# Altium schematic sheet Sheet_2.SchDoc: R2C2 - RepRapCncController
size A3; DrawnBy: FMendes75@gmail.com; Revision: V1.2P; SheetNumber: 2; SheetTotal: 3; =Revision: V1.1; license: Creative Commons BY-NC-SA; site: www.3dprinting-r2c2.com
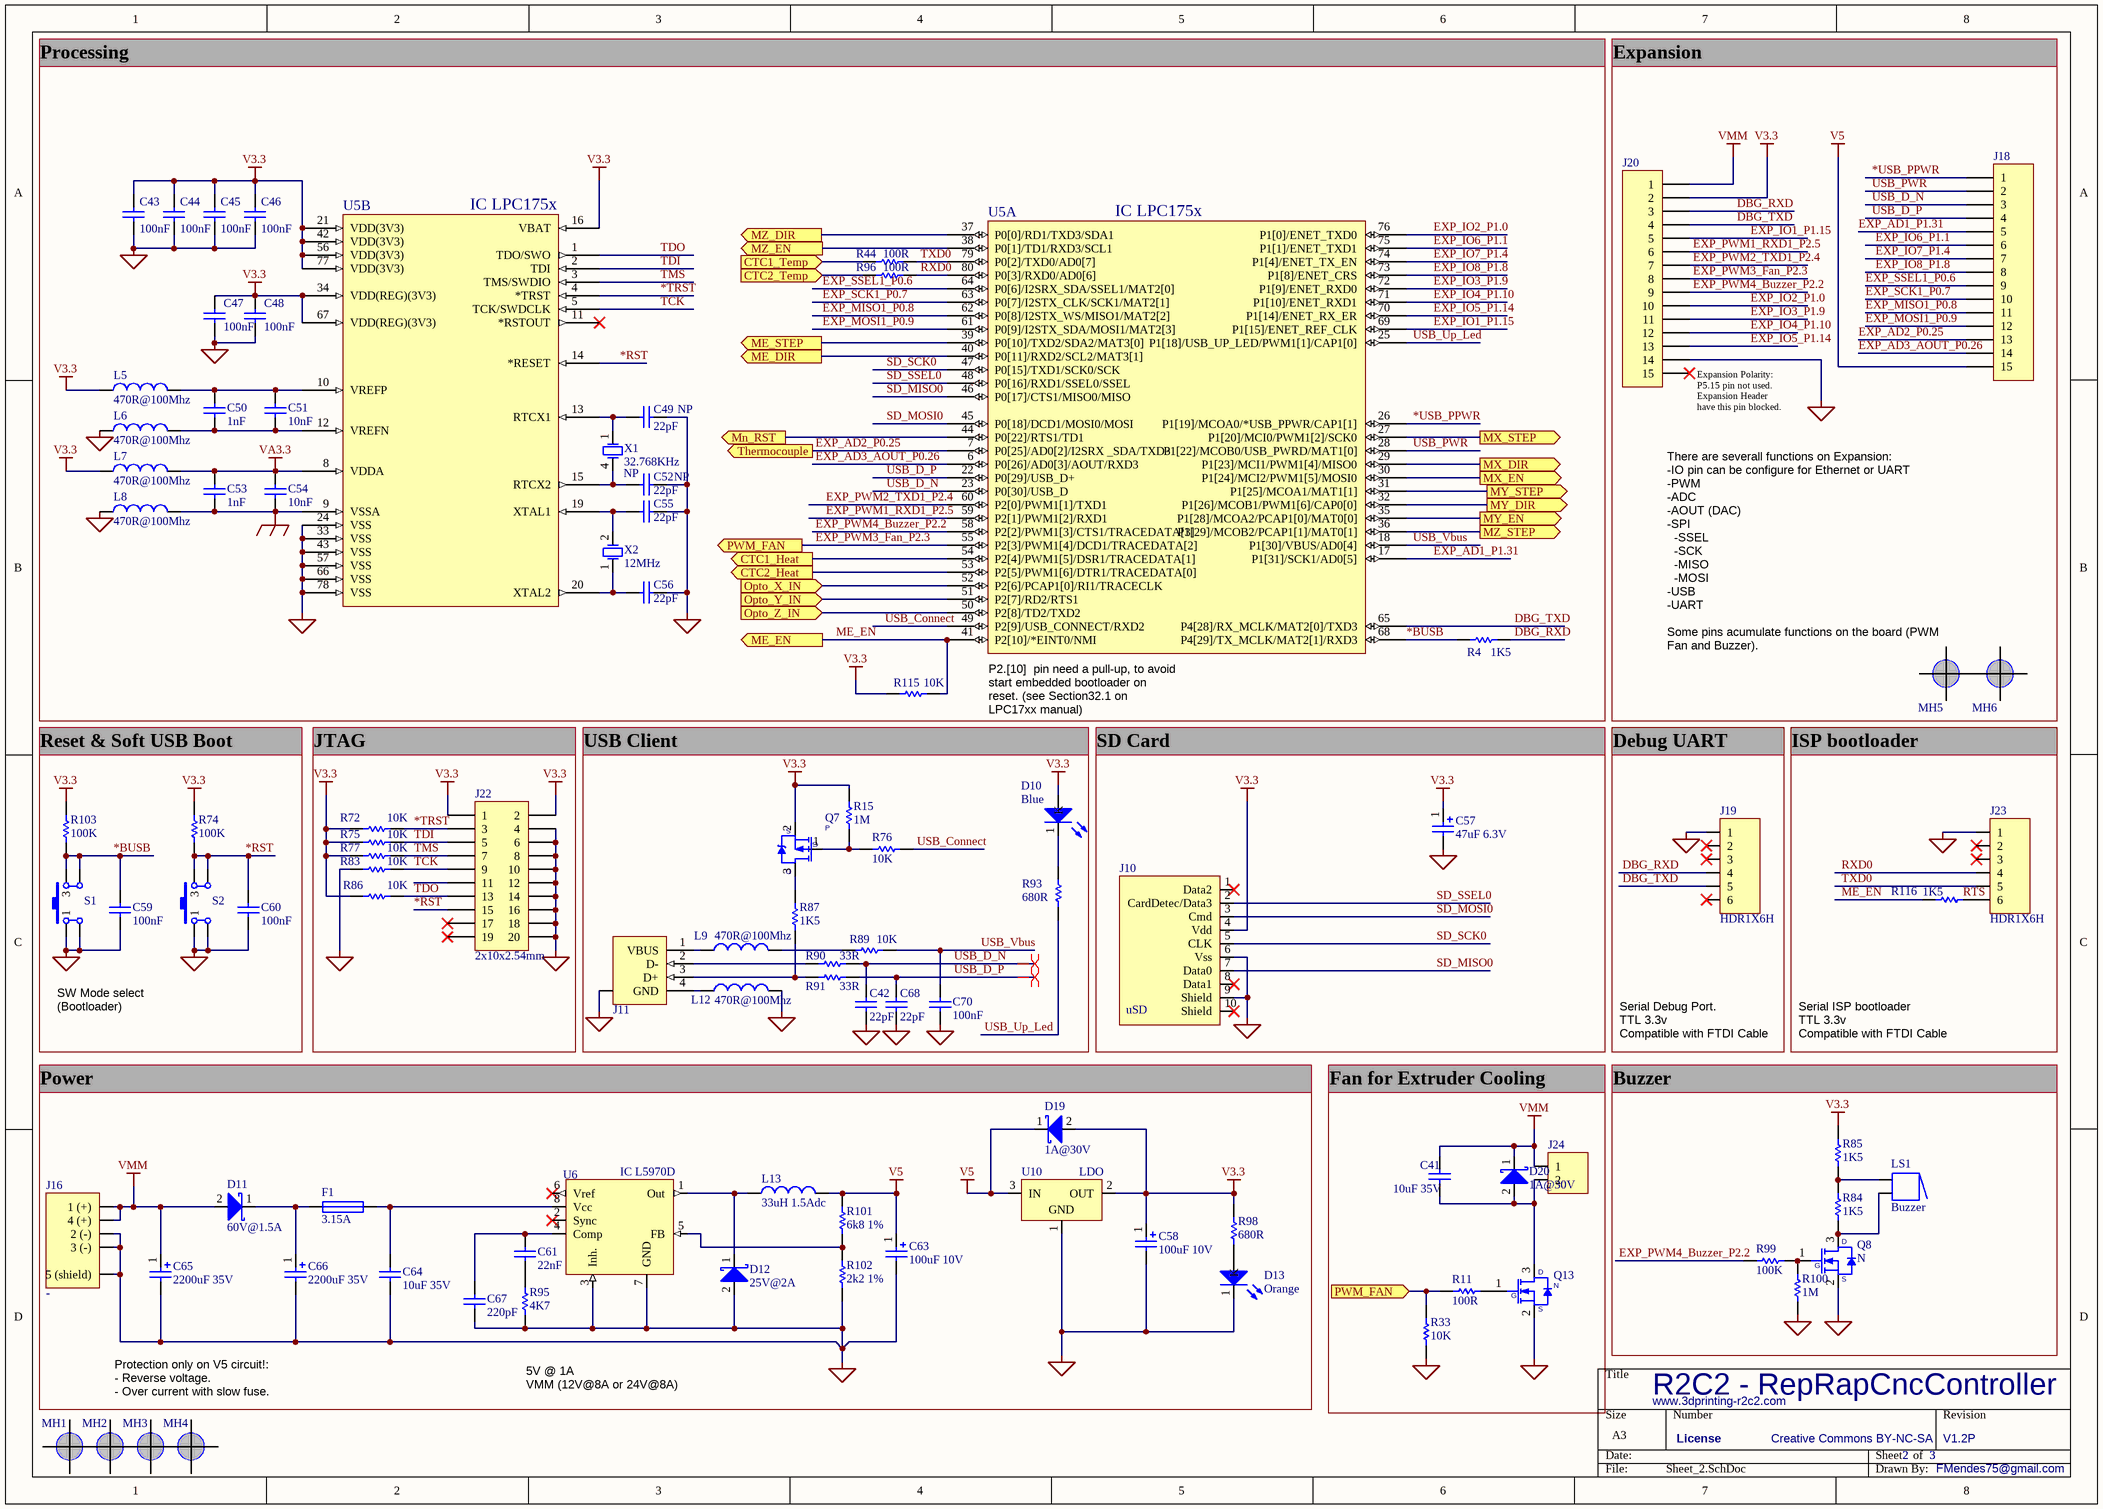
[diagram p0: Sheet_2.SchDoc]

## Parts
C41  10uF 35V  [CAPC3216M]
C42  22pF  [CAPC1608M]
C43  100nF  [CAPC1608M]
C44  100nF  [CAPC1608M]
C45  100nF  [CAPC1608M]
C46  100nF  [CAPC1608M]
C47  100nF  [CAPC1608M]
C48  100nF  [CAPC1608M]
C49  22pF  Populate: NP  [CAPC1608M]
C50  1nF  [CAPC1608M]
C51  10nF  [CAPC1608M]
C52  22pF  Populate: NP  [CAPC1608M]
C53  1nF  [CAPC1608M]
C54  10nF  [CAPC1608M]
C55  22pF  [CAPC1608M]
C56  22pF  [CAPC1608M]
C57  47uF 6.3V  [CAPCP3825M]
C58  100uF 10V  [CAPAE6666X54M]
C59  100nF  [CAPC1608M]
C60  100nF  [CAPC1608M]
C61  22nF  [CAPC1608M]
C63  100uF 10V  [CAPAE6666X54M]
C64  10uF 35V  [CAPC3216M]
C65  2200uF 35V  [CAPPR7.5-16x25]
C66  2200uF 35V  [CAPPR7.5-16x25]
C67  220pF  [CAPC1608M]
C68  22pF  [CAPC1608M]
C70  100nF  [CAPC1608M]
D10  Blue  [LEDM_3216X12M]
D11  60V@1.5A  [SMA]
D12  25V@2A  [SMB]
D13  Orange  [LEDM_3216X12M]
D19  1A@30V  [SOD323]
D20  1A@30V  [SOD323]
F1  3.15A  [RESC1608M]
J10  uSD  [3M_2900]
J11  Con 4 USB  (value not drawn)
J16  -  [KYCON_KPJX-4S]
J18  Con 15  [HDR1X15]  (value not drawn)
J19  HDR1X6H  [HDR1X6H]
J20  Con 15  [HDR1X15]  (value not drawn)
J22  2x10x2.54mm  [HDR2X10]
J23  HDR1X6H  [HDR1X6H]
J24  Con 2  [MOLEX_22-29-2021]  (value not drawn)
L5  470R@100Mhz  [INDC1608M]
L6  470R@100Mhz  [INDC1608M]
L7  470R@100Mhz  [INDC1608M]
L8  470R@100Mhz  [INDC1608M]
L9  470R@100Mhz  [INDC1608M]
L12  470R@100Mhz  [INDC1608M]
L13  33uH 1.5Adc  [INDP9898X58M]
LS1  Buzzer  [TDK_PS17]
MH1  MH  [MH_M3]  (value not drawn)  (no BOM)
MH2  MH  [MH_M3]  (value not drawn)  (no BOM)
MH3  MH  [MH_M3]  (value not drawn)  (no BOM)
MH4  MH  [MH_M3]  (value not drawn)  (no BOM)
MH5  MH  [MH_M3_2]  (value not drawn)  (no BOM)
MH6  MH  [MH_M3_2]  (value not drawn)  (no BOM)
Q7  P  [SOT23-3M]
Q8  N  [SOT323-3AM]
Q13  N  [SOT323-3AM]
R4  1K5  [RESC1608M]
R11  100R  [RESC1608M]
R15  1M  [RESC1608M]
R33  10K  [RESC1608M]
R44  100R  [RESC1608M]
R72  10K  [RESC1608M]
R74  100K  [RESC1608M]
R75  10K  [RESC1608M]
R76  10K  [RESC1608M]
R77  10K  [RESC1608M]
R83  10K  [RESC1608M]
R84  1K5  [RESC1608M]
R85  1K5  [RESC1608M]
R86  10K  [RESC1608M]
R87  1K5  [RESC1608M]
R89  10K  [RESC1608M]
R90  33R  [RESC1608M]
R91  33R  [RESC1608M]
R93  680R  [RESC1608M]
R95  4K7  [RESC1608M]
R96  100R  [RESC1608M]
R98  680R  [RESC1608M]
R99  100K  [RESC1608M]
R100  1M  [RESC1608M]
R101  6k8 1%  [RESC1608M]
R102  2k2 1%  [RESC1608M]
R103  100K  [RESC1608M]
R115  10K  [RESC1608M]
R116  1K5  [RESC1608M]
S1  SW-PB  [SW_FSM6JSMA]  (value not drawn)
S2  SW-PB  [SW_FSM6JSMA]  (value not drawn)
U5  IC LPC175x  [TSQFP50P1400X1400X160-80M]  (parts A,B of 2)
U6  IC L5970D  [SOIC127P600-8M]
U10  LDO  [SOT223-4M]
X1  32.768KHz  Populate: NP  [XTAL_800P380X250-4M]
X2  12MHz  [HC49/4H_SMX]

## Ports
CTC1_Heat (out), CTC1_Temp (in), CTC2_Heat (out), CTC2_Temp (in), ME_DIR (out), ME_EN (out), ME_STEP (out), Mn_RST (out), MX_DIR (out), MX_EN (out), MX_STEP (out), MY_DIR (out), MY_EN (out), MY_STEP (out), MZ_DIR (out), MZ_EN (out), MZ_STEP (out), Opto_X_IN (in), Opto_Y_IN (in), Opto_Z_IN (in), PWM_FAN (in), PWM_FAN (out), Thermocouple (out)

## Nets
GND: C42.1 C43.1 C44.1 C45.2 C46.2 C47.2 C48.2 C49.2 C52.2 C55.2 C56.2 C57.2 C58.2 C59.1 C60.1 C63.2 C64.1 C65.2 C66.2 C67.1 C68.1 C70.1 D12.2(A) D13.1(K) J10.6(Vss) J10.9(Shield) J11.5(SHLD) J16.2(2_(-)) J16.3(3_(-)) J16.5(5_(shield)) J19.1 J20.14 J22.4 J22.6 J22.8 J22.10 J22.12 J22.14 J22.16 J22.18 J22.20 J23.1 L6.1 L8.1 L12.2 Q8.2(S) Q13.2(S) R33.1 R83.1 R95.1 R100.1 R102.1 S1.1 S1.2 S2.1 S2.2 U5.24(VSS) U5.33(VSS) U5.43(VSS) U5.57(VSS) U5.66(VSS) U5.78(VSS) U6.3(Inh.) U6.7(GND) U10.1(GND)
GND_A: C53.1 C54.1 L8.2 U5.9(VSSA)
V3.3: C43.2 C44.2 C45.1 C46.1 C47.1 C48.1 C57.1 C58.1 D10.2(A) D19.2(A) J10.4(Vdd) J20.2 J22.1 J22.2 L5.1 L7.1 Q7.2(S) R15.2 R72.1 R74.2 R75.1 R77.1 R85.2 R86.1 R98.2 R103.2 R115.1 U5.16(VBAT) U5.21(VDD(3V3)) U5.34(VDD(REG)(3V3)) U5.42(VDD(3V3)) U5.56(VDD(3V3)) U5.67(VDD(REG)(3V3)) U5.77(VDD(3V3)) U10.2(OUT)
V5: C63.1 D19.1(K) J18.15 L13.2 R101.2 U10.3(IN)
VA3.3: C53.2 C54.2 L7.2 U5.8(VDDA)
VMM: C41.2 C65.1 D11.2(A) D20.1(K) J16.1(1_(+)) J16.4(4_(+)) J20.1 J24.1
*BUSB: C59.2 R4.1 R103.1 S1.3 S1.4 U5.68(P4[29]/TX_MCLK/MAT2[1]/RXD3)
*RST: C60.2 J22.15 R74.1 S2.3 S2.4 U5.14(*RESET)
*TRST: J22.3 R72.2 U5.4(*TRST)
*USB_PPWR: J18.1 U5.26(P1[19]/MCOA0/*USB_PPWR/CAP1[1])
CTC1_Heat: U5.54(P2[4]/PWM1[5]/DSR1/TRACEDATA[1]) ; port CTC1_Heat
CTC1_Temp: R44.1 ; port CTC1_Temp
CTC2_Heat: U5.53(P2[5]/PWM1[6]/DTR1/TRACEDATA[0]) ; port CTC2_Heat
CTC2_Temp: R96.1 ; port CTC2_Temp
DBG_RXD: J19.4 J20.3 R4.2
DBG_TXD: J19.5 J20.4 U5.65(P4[28]/RX_MCLK/MAT2[0]/TXD3)
EXP_AD1_P1.31: J18.5 U5.17(P1[31]/SCK1/AD0[5])
EXP_AD2_P0.25: J18.13 U5.7(P0[25]/AD0[2]/I2SRX__SDA/TXD3) ; port Thermocouple
EXP_AD3_AOUT_P0.26: J18.14 U5.6(P0[26]/AD0[3]/AOUT/RXD3)
EXP_IO1_P1.15: J20.5 U5.69(P1[15]/ENET_REF_CLK)
EXP_IO2_P1.0: J20.10 U5.76(P1[0]/ENET_TXD0)
EXP_IO3_P1.9: J20.11 U5.72(P1[9]/ENET_RXD0)
EXP_IO4_P1.10: J20.12 U5.71(P1[10]/ENET_RXD1)
EXP_IO5_P1.14: J20.13 U5.70(P1[14]/ENET_RX_ER)
EXP_IO6_P1.1: J18.6 U5.75(P1[1]/ENET_TXD1)
EXP_IO7_P1.4: J18.7 U5.74(P1[4]/ENET_TX_EN)
EXP_IO8_P1.8: J18.8 U5.73(P1[8]/ENET_CRS)
EXP_MISO1_P0.8: J18.11 U5.62(P0[8]/I2STX_WS/MISO1/MAT2[2])
EXP_MOSI1_P0.9: J18.12 U5.61(P0[9]/I2STX_SDA/MOSI1/MAT2[3])
EXP_PWM1_RXD1_P2.5: J20.6 U5.59(P2[1]/PWM1[2]/RXD1)
EXP_PWM2_TXD1_P2.4: J20.7 U5.60(P2[0]/PWM1[1]/TXD1)
EXP_PWM3_Fan_P2.3: J20.8 R11.1 R33.2 U5.55(P2[3]/PWM1[4]/DCD1/TRACEDATA[2]) ; port PWM_FAN
EXP_PWM4_Buzzer_P2.2: J20.9 R99.1 U5.58(P2[2]/PWM1[3]/CTS1/TRACEDATA[3])
EXP_SCK1_P0.7: J18.10 U5.63(P0[7]/I2STX_CLK/SCK1/MAT2[1])
EXP_SSEL1_P0.6: J18.9 U5.64(P0[6]/I2SRX_SDA/SSEL1/MAT2[0])
ME_DIR: U5.40(P0[11]/RXD2/SCL2/MAT3[1]) ; port ME_DIR
ME_EN: R115.2 R116.1 U5.41(P2[10]/*EINT0/NMI) ; port ME_EN
ME_STEP: U5.39(P0[10]/TXD2/SDA2/MAT3[0]) ; port ME_STEP
Mn_RST: U5.44(P0[22]/RTS1/TD1) ; port Mn_RST
MX_DIR: U5.29(P1[23]/MCI1/PWM1[4]/MISO0) ; port MX_DIR
MX_EN: U5.30(P1[24]/MCI2/PWM1[5]/MOSI0) ; port MX_EN
MX_STEP: U5.27(P1[20]/MCI0/PWM1[2]/SCK0) ; port MX_STEP
MY_DIR: U5.32(P1[26]/MCOB1/PWM1[6]/CAP0[0]) ; port MY_DIR
MY_EN: U5.35(P1[28]/MCOA2/PCAP1[0]/MAT0[0]) ; port MY_EN
MY_STEP: U5.31(P1[25]/MCOA1/MAT1[1]) ; port MY_STEP
MZ_DIR: U5.37(P0[0]/RD1/TXD3/SDA1) ; port MZ_DIR
MZ_EN: U5.38(P0[1]/TD1/RXD3/SCL1) ; port MZ_EN
MZ_STEP: U5.36(P1[29]/MCOB2/PCAP1[1]/MAT0[1]) ; port MZ_STEP
Opto_X_IN: U5.52(P2[6]/PCAP1[0]/RI1/TRACECLK) ; port Opto_X_IN
Opto_Y_IN: U5.51(P2[7]/RD2/RTS1) ; port Opto_Y_IN
Opto_Z_IN: U5.50(P2[8]/TD2/TXD2) ; port Opto_Z_IN
RXD0: J23.4 R96.2 U5.80(P0[3]/RXD0/AD0[6])
SD_MISO0: J10.7(Data0) U5.46(P0[17]/CTS1/MISO0/MISO)
SD_MOSI0: J10.3(Cmd) U5.45(P0[18]/DCD1/MOSI0/MOSI)
SD_SCK0: J10.5(CLK) U5.47(P0[15]/TXD1/SCK0/SCK)
SD_SSEL0: J10.2(CardDetec/Data3) U5.48(P0[16]/RXD1/SSEL0/SSEL)
TCK: J22.9 R83.2 U5.5(TCK/SWDCLK)
TDI: J22.5 R75.2 U5.2(TDI)
TDO: J22.13 R86.2 U5.1(TDO/SWO)
TMS: J22.7 R77.2 U5.3(TMS/SWDIO)
TXD0: J23.5 R44.2 U5.79(P0[2]/TXD0/AD0[7])
USB_Connect: R76.2 U5.49(P2[9]/USB_CONNECT/RXD2)
USB_D_N: C42.2 J18.3 R90.2 U5.23(P0[30]/USB_D)
USB_D_P: C68.2 J18.4 R91.2 U5.22(P0[29]/USB_D+)
USB_PWR: J18.2 U5.28(P1[22]/MCOB0/USB_PWRD/MAT1[0])
USB_Up_Led: R93.1 U5.25(P1[18]/USB_UP_LED/PWM1[1]/CAP1[0])
USB_Vbus: C70.2 R89.2 U5.18(P1[30]/VBUS/AD0[4])
NetC41_1: C41.1 D20.2(A) J24.2 Q13.3(D)
NetC49_1: C49.1 U5.13(RTCX1) X1.1(OSC1)
NetC50_1: C50.1 C51.1 L6.2 U5.12(VREFN)
NetC50_2: C50.2 C51.2 L5.2 U5.10(VREFP)
NetC52_1: C52.1 U5.15(RTCX2) X1.4(OSC2)
NetC55_1: C55.1 U5.19(XTAL1) X2.2(OSC2)
NetC56_1: C56.1 U5.20(XTAL2) X2.1(OSC1)
NetC61_1: C61.1 R95.2
NetC61_2: C61.2 C67.2 U6.4(Comp)
NetC64_2: C64.2 F1.2 U6.8(Vcc)
NetC66_1: C66.1 D11.1(K) F1.1
NetD10_1: D10.1(K) R93.2
NetD12_1: D12.1(K) L13.1 U6.1(Out)
NetD13_2: D13.2(A) R98.1
NetJ11_1: J11.1(VBUS) L9.1
NetJ11_2: J11.2(D-) R90.1
NetJ11_3: J11.3(D+) R87.1 R91.1
NetJ11_4: J11.4(GND) L12.1
NetJ23_6: J23.6 R116.2
NetL9_2: L9.2 R89.1
NetLS1_1: LS1.1 R84.2 R85.1
NetLS1_2: LS1.2 Q8.3(D) R84.1
NetQ7_1: Q7.1(G) R15.1 R76.1
NetQ7_3: Q7.3(D) R87.2
NetQ8_1: Q8.1(G) R99.2 R100.2
NetQ13_1: Q13.1(G) R11.2
NetR101_1: R101.1 R102.2 U6.5(FB)

Not connected (* = marked no-connect by the designer): J10 1(Data2)* 8(Data1)* 10(Shield)*; J19 2* 3* 6*; J20 15*; J22 11 17* 19*; J23 2* 3*; U5 11(*RSTOUT)*; U6 2(Sync)* 6(Vref)*

## Layout directives
differential pair: USB_D_N, USB_D_P

## Notes on the sheet
- Processing
- Expansion
- (near J20) Expansion Polarity: P5.15 pin not used.
  Expansion Header have this pin blocked.
- (near U5) P2.[10]  pin need a pull-up, to avoid start embedded bootloader on reset. (see Section32.1 on LPC17xx manual)
- (near MH5) There are severall functions on Expansion:
  -IO pin can be configure for Ethernet or UART
  -PWM
  -ADC
  -AOUT (DAC)
  -SPI
  -SSEL
  -SCK
  -MISO
  -MOSI
  -USB
  -UART
  Some pins acumulate functions on the board (PWM Fan and Buzzer).
- Reset & Soft USB Boot
- JTAG
- USB Client
- SD Card
- Debug UART
- ISP bootloader
- SW Mode select (Bootloader)
- Serial Debug Port.
  TTL 3.3v
  Compatible with FTDI Cable
- Serial ISP bootloader
  TTL 3.3v
  Compatible with FTDI Cable
- Power
- Fan for Extruder Cooling
- (near R85) Buzzer
- Protection only on V5 circuit!:
  - Reverse voltage.
  - Over current with slow fuse.
- 5V @ 1A
  VMM (12V@8A or 24V@8A)
- License
- Labels drawn without touching a wire or pin: RTS

## Library data of the parts
C41 C64 = 10000002: Capacitor - MLCC; 10uF; 35V;; Manufacturer: Taiyo Yuden; Type: smd; Designator: C; Man PN: GMK316F106ZL-T; Pack: 1206; Distri Price1: 0,1; Distri Qty1: 100; Part Number: 10000002; Component Type: Standard; Value: 10uF 35V; Pin Count: 2; Distri Link1: http://pt.farnell.com/taiyo-yuden/gmk316f106zl-t/capacitor-mlcc/dp/1611967; Stock: 0
C42 C49 C52 C55 C56 C68 = 10000056: Capacitor - MLCC; 0603; NP0; 50V; Manufacturer: Multicomp; Type: smd; Designator: C; Pack: 0603; Distri Price1: 0,08; Distri Qty1: 100; Distri Price2: 0,013; Part Number: 10000056; Component Type: Standard; Value: 22pF; Pin Count: 2; Distri Link1: http://pt.farnell.com/multicomp/mcca000196/mlcc-0603-np0-50v-22pf/dp/1759057; Distri Link2: http://search.digikey.com/scripts/DkSearch/dksus.dll?Detail&name=445-1273-1-ND; Distri Qty2: 100
C43-C48 C59 C60 C70 = 10000054: Capacitor - MLCC; 0603; NP0; 50V; Manufacturer: Multicomp; Type: smd; Designator: C; Man PN: MCCA000255; Pack: 0603; Distri Price1: 0,008; Distri Qty1: 100; Part Number: 10000054; Value: 100nF; Pin Count: 2; Distri Link1: http://pt.farnell.com/multicomp/mcca000255/mlcc-0603-x7r-50v-100nf/dp/1759122; Component Type: Standard
C50 C53 = 10000058: Capacitor - MLCC; 0603; NP0; 50V; Manufacturer: Multicomp; Type: smd; Designator: C; Pack: 0603; Distri Price1: 0,08; Distri Qty1: 100; Distri Price2: 0,009; Part Number: 10000058; Value: 1nF; Pin Count: 2; Distri Link1: http://pt.farnell.com/multicomp/mcca000224/mlcc-0603-x7r-50v-1nf/dp/1759088; Distri Link2: http://search.digikey.com/scripts/DkSearch/dksus.dll?Detail&name=490-1494-1-ND; Distri Qty2: 100; Component Type: Standard
C51 C54 = 10000057: Capacitor - MLCC; 0603; NP0; 50V; Manufacturer: Multicomp; Type: smd; Designator: C; Pack: 0603; Distri Price1: 0,08; Distri Qty1: 100; Distri Price2: 0,008; Part Number: 10000057; Value: 10nF; Pin Count: 2; Distri Link1: http://pt.farnell.com/multicomp/mcca000165/mlcc-0603-x7r-25v-10nf/dp/1759022; Distri Link2: http://search.digikey.com/scripts/DkSearch/dksus.dll?Detail&name=490-1512-1-ND; Distri Qty2: 100; Component Type: Standard
C57 = 10000005: Capacitor - MLCC Y5V; 47UF; 6.3V; Manufacturer: MULTICOMP; Type: smd; Designator: C; Man PN: MCCA000491; Pack: 1210; Distri Price1: 0,3; Distri Qty1: 100; Part Number: 10000005; Component Type: Standard; Value: 47uF 6.3V; Pin Count: 2; Distri Link1: http://pt.farnell.com/multicomp/mcca000491/mlcc-12105v-6-3v-47uf/dp/1759367; Stock: 0
C58 C63 = 10000086: Capacitor - Al. Electrolytic; 100uF, 16V; Manufacturer: Nichicon; Type: smd; Designator: C; Man PN: UWX1C101MCL1GB; Distri Price1: 0,174; Distri Qty1: 100; Part Number: 10000086; Component Type: Standard; Value: 100uF 10V; Pack: -; Pin Count: 2; Distri Link1: http://pt.farnell.com/nichicon/uwx1c101mcl1gb/capacitor-100uf-16v/dp/8823065; Distri Link2: -; Distri Price2: -; Distri Qty2: -; Stock: 0; ComponentLink1Description: -; ComponentLink1URL: -; ComponentLink2Description: -; ComponentLink2URL: -; Signal Integrity: -; Simulation: -; Verified: 03-04-2011
C61 = 10000066: Capacitor - MLCC; 0603; NP0; 50V; Manufacturer: Multicomp; Type: smd; Designator: C; Pack: 0603; Distri Qty1: 0; Part Number: 10000066; Value: 22nF; Pin Count: 2; Component Type: Standard
C65 C66 = 10000006: Capacitor - Al. Electrolytic; 2200uF; 35V; Manufacturer: PANASONIC; Type: THD; Designator: C; Man PN: ECA1VM222; Distri Price1: 0,53; Distri Qty1: 100; Part Number: 10000006; Component Type: Standard; Value: 2200uF 35V; Pin Count: 2; Distri Link1: http://pt.farnell.com/panasonic/eca1vm222/capacitor-2200uf-35v/dp/9693726; Stock: 0
C67 = 10000055: Capacitor - MLCC; 0603; NP0; 50V; Manufacturer: Multicomp; Type: smd; Designator: C; Pack: 0603; Distri Price1: 0,08; Distri Qty1: 100; Distri Price2: 0,014; Part Number: 10000055; Value: 220pF; Pin Count: 2; Distri Link1: http://pt.farnell.com/multicomp/mcca000209/mlcc-0603-np0-50v-220pf/dp/1759071; Distri Link2: http://search.digikey.com/scripts/DkSearch/dksus.dll?Detail&name=445-1306-1-ND; Distri Qty2: 100; Component Type: Standard
D10 = 10000065: Led - 1206; Blue OSRAM; Type: smd; Designator: D; Pack: 1206; Distri Qty1: 0; Part Number: 10000065; Man PN: -; Manufacturer: OSRAM; Value: Blue; Pin Count: 2; Component Type: Standard
D11 = 10000010: Diode - Schottky; 1.5A; 60V; Manufacturer: VISHAY; Type: smd; Designator: D; Man PN: VS-10MQ060NTRPBF; Distri Price1: 0,092; Distri Qty1: 100; Part Number: 10000010; Component Type: Standard; Value: 60V@1.5A; Pack: SMA; Pin Count: 2; Distri Link1: http://pt.farnell.com/vishay-formerly-i-r/vs-10mq060ntrpbf/diode-schottky-1-5a-60v/dp/1463213; Stock: 0
D12 = 10000009: Diode - Schottky; 25V; 2A; Manufacturer: ST; Type: smd; Designator: D; Man PN: STPS2L25; Distri Price1: 0,21; Distri Qty1: 1; Part Number: 10000009; Component Type: Standard; Value: 25V@2A; Pack: SMB; Pin Count: 2; Distri Link1: http://pt.farnell.com/stmicroelectronics/stps2l25u/schottky-2a-25v-smb/dp/1752177; Stock: 0
D13 = 10000007: Led - 1206; Orange OSRAM; Type: smd; Designator: D; Man PN: LYN971-Z; Pack: 1206; Distri Price1: 0,063; Distri Qty1: 100; Part Number: 10000007; Manufacturer: OSRAM; Value: Orange; Pin Count: 2; Distri Link1: http://pt.farnell.com/osram/lyn971-z/led-smd-yellow/dp/1226417; Stock: 0; Component Type: Standard
D19 D20 = 10000085: Diode - Schottky; 30V; 1A;; Manufacturer: NXP; Type: smd; Designator: D; Man PN: PMEG3010CEJ,115; Pack: SOD323F; Distri Price1: 0,064; Distri Qty1: 100; Part Number: 10000085; Component Type: Standard; Value: 1A@30V; Pin Count: 2; Distri Link1: http://pt.farnell.com/nxp/pmeg3010cej-115/schottky-rect-30v-1a-sod323f/dp/1757769; Distri Link2: -; Distri Price2: -; Distri Qty2: -; Stock: 0; ComponentLink1Description: -; ComponentLink1URL: -; ComponentLink2Description: -; ComponentLink2URL: -; Signal Integrity: -; Simulation: -; Verified: 03-04-2011
F1 = 10000011: Fuse - 0603; Itrip=3.15A; Manufacturer: Bourns; Type: smd; Man PN: SF-0603F315-2; Pack: 0603; Distri Price1: 0,124; Distri Qty1: 10; Part Number: 10000011; Designator: F; Value: 3.15A; Pin Count: 2; Distri Link1: http://pt.farnell.com/bourns/sf-0603f315-2/fuse-smd-0603-3-15a/dp/1652136; Stock: 0; Component Type: Standard
J10 = 10000029: Connector - MicroSD Card 8pin; PCB; Gold; Manufacturer: Amphenol; Designator: J; Man PN: 101-00581-59; Distri Price1: 0,888; Distri Qty1: 100; Distri Price2: 0,897; Part Number: 10000029; Type: smd; Value: uSD; Distri Link2: http://search.digikey.com/scripts/DkSearch/dksus.dll?Detail&name=101-00581-59-1-ND; Distri Qty2: 100; Stock: 0; Component Type: Standard
J16 = 10000099: Connector - PCB; Female Receptacle; 4 way; Hor.; Manufacturer: Kycon; Designator: J; Man PN: KPJX-4S; Distri Price1: 0; Part Number: 10000099; Component Type: Standard; Type: THD; Value: -; Pack: -; Pin Count: 5; Distri Link1: -; Distri Qty1: 0
J18 J20 = 10000067: Connector - Header 15x1; Designator: J; Distri Price1: 0,78; Distri Qty1: 100; Distri Price2: 0,779; Part Number: 10000067; Type: THD; Pin Count: 15; Distri Link1: http://pt.farnell.com/molex/90120-0935/header-2-54mm-15way/dp/1756979; Distri Link2: http://search.digikey.com/scripts/DkSearch/dksus.dll?Detail&name=WM2783-ND; Distri Qty2: 100; Component Type: Standard
J19 J23 = 10000074: Connector - Header 1x6; Hor.; Designator: J; Distri Price1: 0; Part Number: 10000074; Type: THD; Man PN: -; Manufacturer: -; Value: HDR1X6H; Pack: -; Pin Count: 6; Distri Link1: -; Distri Qty1: 0; Component Type: Standard
J22 = 10000064: Connector - PCB; Male Receptacle; 2.54mm; 2way; Vert.; Manufacturer: SAMTEC; Designator: J; Man PN: SSA-102-S-G; Distri Price1: 0,146; Distri Qty1: 100; Part Number: 10000064; Type: THD; Value: 2x10x2.54mm; Pin Count: 20; Distri Link1: http://pt.farnell.com/samtec/ssa-102-s-g/receptacle-2-54mm-pcb-2way/dp/1668221; Component Type: Standard
J24 = 10000097: Connector - PCB; Header; SQ Pin, 2 way; 2.54mm; Vert; Manufacturer: Molex; Designator: J; Distri Qty1: 0; Part Number: 10000097; Component Type: Standard; Type: smd; Man PN: 22-29-2021; Value: -; Pack: -; Pin Count: 2; Distri Link1: http://pt.farnell.com/molex/22-29-2021/header-vertical-sq-pin-0-1-2way/dp/1360130; Distri Price2: 0
L5-L9 L12 = 10000032: Ferrite Bead - 470OHM; 0603; Manufacturer: MURATA; Type: smd; Designator: L; Man PN: BLM18PG471SN1D; Pack: 0603; Distri Price1: 0,034; Distri Qty1: 100; Part Number: 10000032; Value: 470R@100Mhz; Pin Count: 2; Stock: 0; Component Type: Standard
L13 = 10000081: Inductor - 33uH; Isat=2.9A; In=1.5A; Manufacturer: Bourns; Type: smd; Designator: L; Man PN: SDR1006-330KL; Pack: 10x10x5.8; Distri Price1: 0,74; Distri Qty1: 50; Part Number: 10000081; Value: 33uH 1.5Adc; Pin Count: 2; Distri Link1: http://pt.farnell.com/bourns/sdr1006-330kl/inductor-smd-33uh-2-9a/dp/1828081; Distri Link2: -; Distri Price2: -; Distri Qty2: -; Stock: 0; ComponentLink1URL: -; ComponentLink2Description: -; ComponentLink2URL: -; Signal Integrity: -; Simulation: -; Component Type: Standard; Verified: 03-03-2011
LS1 = 10000068: Buzzer - Piezo; 70dB; Diam.17mm; Manufacturer: TDK; Designator: X; Man PN: PS1720P02; Pack: 1010; Distri Price1: 0,35; Distri Qty1: 100; Part Number: 10000068; Type: THD; Pin Count: 0; Distri Link1: http://pt.farnell.com/tdk/ps1720p02/buzzer-piezo-70db-17mm/dp/1669968; Component Type: Standard
MH1-MH4 = 1000000: PCB Symbol - Mounting Hole M3; Distri Price1: 0; Part Number: 1000000; Type: THD; Designator: MH; Man PN: -; Manufacturer: -; Value: -; Pack: -; Pin Count: 1; Distri Link1: -; Distri Qty1: 0; Component Type: Standard (No BOM)
MH5 MH6 = 100001: PCB Symbol - Mounting Hole M3; Part Number: 100001; Distri Qty1: 0; Component Type: Standard (No Bom); Type: THD; Designator: MH; Man PN: -; Manufacturer: -; Value: -; Pack: -; Pin Count: 1
Q7 = 10000076: Mosfet - Power; Vdss=-30v; Rds=0.60; Id=-0.6A; Manufacturer: IR; Type: smd; Designator: Q; Man PN: IRLML5103; Value: 0.6A; Pack: Sot-23; Distri Price1: 0,128; Distri Qty1: 100; Part Number: 10000076; Component Type: Standard; Pin Count: 3; Distri Link1: http://pt.farnell.com/international-rectifier/irlml5103trpbf/mosfet-p-micro3/dp/1463265; Distri Link2: -; Distri Price2: -; Distri Qty2: -; Stock: 0; ComponentLink1URL: -; ComponentLink2Description: -; ComponentLink2URL: -; Signal Integrity: -; Simulation: -
Q8 Q13 = 10000039: Mosfet - N; 60V; 0.3A;; Manufacturer: NXP; Type: smd; Designator: Q; Man PN: 2N7002PW; Pack: SOT323; Distri Price1: 0,025; Distri Qty1: 100; Part Number: 10000039; Distri Link1: http://pt.farnell.com/nxp/2n7002pw/mosfet-n-ch-60v-0-3a-sot323/dp/1829184; Stock: 0; Component Type: Standard
R4 = 10000048: Resistor; Manufacturer: Multicomp; Designator: R; Man PN: MC 0.063W 0603 1% 1K5; Description: Resistor - 0603; 0.063W; 1%; Pack: 0603; Distri Qty1: 0; Part Number: 10000048; Component Type: Standard; Type: smd; Value: 1K5; Pin Count: 2
R11 = 10000042: Resistor - 0603; 0.063W; 1%; Manufacturer: Multicomp; Designator: R; Man PN: MC 0.063W 0603 1% 100R; Pack: 0603; Distri Price1: 0,006; Distri Qty1: 250; Part Number: 10000042; Type: smd; Value: 100R; Pin Count: 2; Distri Link1: http://pt.farnell.com/multicomp/mc-0-063w-0603-1-100r/resistor-0603-100r-0-063w-1/dp/9330364; Stock: 0; Component Type: Standard
R15 R100 = 10000049: Resistor - 0603; 0.063W; 1%; Manufacturer: Multicomp; Designator: R; Man PN: MC 0.063W 0603 1% 1M; Pack: 0603; Distri Qty1: 0; Part Number: 10000049; Type: smd; Value: 1M; Pin Count: 2; Component Type: Standard
R33 R72 R75-R77 R83 R86 R89 R115 = 10000044: Resistor - 0603; 0.063W; 1%; Manufacturer: Multicomp; Designator: R; Man PN: MC 0.063W 0603 1% 10K; Pack: 0603; Distri Qty1: 0; Part Number: 10000044; Type: smd; Value: 10K; Pin Count: 2; Component Type: Standard
R44 R96 = 10000042: Resistor - 0603; 0.063W; 1%; Manufacturer: Multicomp; Designator: R; Man PN: MC 0.063W 0603 1% 100R; Pack: 0603; Distri Qty1: 250; Distri Price1: 0,006; Part Number: 10000042; Component Type: Standard; Type: smd; Value: 100R; Pin Count: 2; Distri Link1: http://pt.farnell.com/multicomp/mc-0-063w-0603-1-100r/resistor-0603-100r-0-063w-1/dp/9330364; Stock: 0
R74 R99 R103 = 10000045: Resistor - 0603; 0.063W; 1%; Manufacturer: Multicomp; Designator: R; Man PN: MC 0.063W 0603 1% 100K; Pack: 0603; Distri Qty1: 0; Part Number: 10000045; Type: smd; Value: 100K; Pin Count: 2; Component Type: Standard
R84 R85 R87 R116 = 10000048: Resistor - 0603; 0.063W; 1%; Manufacturer: Multicomp; Designator: R; Man PN: MC 0.063W 0603 1% 1K5; Pack: 0603; Distri Qty1: 0; Part Number: 10000048; Type: smd; Value: 1K5; Pin Count: 2; Component Type: Standard
R90 R91 = 10000053: Resistor - 0603; 0.063W; 1%; Manufacturer: Multicomp; Designator: R; Man PN: MC 0.063W 0603 1% 33R; Pack: 0603; Distri Qty1: 0; Part Number: 10000053; Type: smd; Value: 33R; Pin Count: 2; Component Type: Standard
R93 R98 = 10000061: Resistor - 0603; 0.063W; 1%; Manufacturer: Multicomp; Designator: R; Man PN: MC 0.063W 0603 1% 680R; Pack: 0603; Distri Price1: 0,016; Distri Qty1: 100; Distri Price2: 0,006; Part Number: 10000061; Type: smd; Value: 680R; Pin Count: 2; Distri Link1: http://pt.farnell.com/multicomp/mc-0-063w-0603-5-680r/resistor-0603-680r/dp/9332251; Component Type: Standard; Distri Link2: http://pt.farnell.com/multicomp/mc-0-063w-0603-5-680r/resistor-0603-680r/dp/9332251; Distri Qty2: 100
R95 = 10000050: Resistor - 0603; 0.063W; 1%; Manufacturer: Multicomp; Designator: R; Man PN: MC 0.063W 0603 1% 4K7; Pack: 0603; Distri Qty1: 0; Part Number: 10000050; Type: smd; Value: 4K7; Pin Count: 2; Component Type: Standard
R101 = 10000080: Resistor - 0603; 0.063W; 1%; Manufacturer: Vishay; Designator: R; Man PN: CRCW06036K80FKEA; Pack: 0603; Distri Price1: 0,018; Distri Qty1: 0; Part Number: 10000080; Type: smd; Value: 6k8 1%; Pin Count: 2; Distri Link1: http://pt.farnell.com/vishay-draloric/crcw06036k80fkea/resistor-0603-6-8kr-1/dp/1469831; Component Type: Standard
R102 = 10000079: Resistor - 0603; 0.063W; 1%; Manufacturer: Vishay; Designator: R; Man PN: CRCW06032K20FKEA; Pack: 0603; Distri Price1: 0,018; Distri Qty1: 250; Part Number: 10000079; Type: smd; Value: 2k2 1%; Pin Count: 2; Distri Link1: http://pt.farnell.com/vishay-draloric/crcw06032k20fkea/resistor-2-2kr-100mw-1/dp/1469765; Distri Link2: -; Distri Price2: -; Distri Qty2: -; Stock: 0; ComponentLink1Description: -; ComponentLink1URL: -; ComponentLink2Description: -; ComponentLink2URL: -; Signal Integrity: -; Simulation: -; Component Type: Standard; Verified: 03-03-2011
S1 S2 = 10000019: Switch - Micro; Tactile; SPNO; Manufacturer: TYCO; Designator: J; Man PN: FSM6JSMA; Distri Price1: 0,2; Distri Qty1: 100; Part Number: 10000019; Type: THD; Pin Count: 4; Distri Link1: http://pt.farnell.com/tyco-electronics-alcoswitch/fsm6jsma/switch-tactile-spno-smd/dp/1555991; Stock: 0; Component Type: Standard
U5 = 10000013: IC - uController ARM Cortex-M3, 100MHz; Manufacturer: NXP; Man PN: LPC1756FBD80; Pack: LQFP80; Distri Qty1: 100; Distri Price2: 5,7675; Part Number: 10000013; Type: smd; Designator: IC; Distri Link2: http://search.digikey.com/scripts/DkSearch/dksus.dll?vendor=0&keywords=LPC1756&stock=1; Distri Qty2: 100; Stock: 0; Component Type: Standard
U6 = 10000017: IC - DC-DC Reg.; Manufacturer: ST; Pack: SO-8; Distri Price1: 2,14; Distri Qty1: 100; Part Number: 10000017; Type: smd; Designator: IC; Man PN: L5970D; Pin Count: 8; Distri Link1: http://pt.farnell.com/jsp/search/productdetail.jsp?sku=1077141; Stock: 0; Component Type: Standard
U10 = 10000082: IC - Fixed LDO Voltage Reg 3.3V 800mA; Manufacturer: TI; Designator: U; Man PN: TLV1117-33CDCY; Pack: Sot-232; Distri Price1: 0,28; Distri Qty1: 100; Part Number: 10000082; Type: smd; Value: -; Pin Count: 3; Distri Link1: http://pt.farnell.com/texas-instruments/tlv1117-33cdcy/v-reg-ldo-3-3v-0-8a-sot-223-4/dp/1494942; Distri Link2: -; Distri Price2: -; Distri Qty2: -; Stock: 0; ComponentLink1Description: -; ComponentLink1URL: -; ComponentLink2Description: -; ComponentLink2URL: -; Signal Integrity: -; Simulation: -; Component Type: Standard; Verified: 03-03-2011
X1 = 10000063: Crystal - 32.768 kHz Low Profile; PLastic; Manufacturer: ABRACON; Designator: Xtal; Man PN: ABS25; Distri Price1: 0,41; Distri Qty1: 100; Part Number: 10000063; Type: smd; Value: 32.768KHz; Pin Count: 4; Distri Link1: http://pt.farnell.com/abracon/abs25-32-768khz-t/crystal-32-768k-12-5pf-cl-8x2-5/dp/1611824; Component Type: Standard
X2 = 10000040: Crystal - 12.0MHz; Man PN: 9C-12.000MAAJ-T; Distri Price1: 0,44; Distri Qty1: 100; Part Number: 10000040; Type: smd; Designator: Xtal; Value: 12MHz; Stock: 0; Component Type: Standard